# Altium project Kojiki 3.PrjPCB (part 2 of 2)

## Sheet Power_Decap.SchDoc: Power
size A4; Date: 01/09/2020; ApprovedBy: Edson Manoel da Silva; CheckedBy: Edson Manoel da Silva; Author: Edson Manoel da Silva; CompanyName: EMS; DrawnBy: Edson Manoel da Silva; Engineer: Edson Manoel da Silva; Organization: EMS; Address1: Av Helvino Moraes, 1385; Address2: APT 11E; Address3: Vila São José; Address4: Taubaté/SP - Brasil; DocumentNumber: 1; Revision: 1; SheetNumber: 1; SheetTotal: 5; Rule: 5
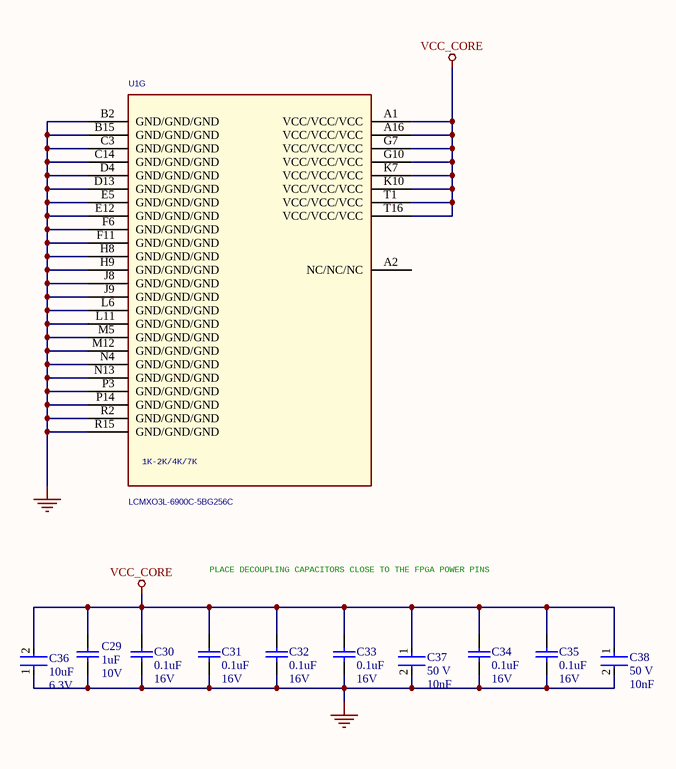
[diagram p6: Power_Decap.SchDoc]

### Parts
C29  value 1uF  Voltage: 10V  [CAPC1608X90X35ML15T15]  (hidden comment: C0603C105K8RACTU)
C30  value 0.1uF  Voltage: 16V  [CAPC1608X87X35ML15T15]  (hidden comment: C0603C104M4RACTU)
C31  value 0.1uF  Voltage: 16V  [CAPC1608X87X35ML15T15]  (hidden comment: C0603C104M4RACTU)
C32  value 0.1uF  Voltage: 16V  [CAPC1608X87X35ML15T15]  (hidden comment: C0603C104M4RACTU)
C33  value 0.1uF  Voltage: 16V  [CAPC1608X87X35ML15T15]  (hidden comment: C0603C104M4RACTU)
C34  value 0.1uF  Voltage: 16V  [CAPC1608X87X35ML15T15]  (hidden comment: C0603C104M4RACTU)
C35  value 0.1uF  Voltage: 16V  [CAPC1608X87X35ML15T15]  (hidden comment: C0603C104M4RACTU)
C36  value 10uF  Voltage: 6.3V  [FP-CL10-IPC_C]  (hidden comment: CL10A106MQ8NNNC)
C37  value 10nF  Voltage: 50 V  [FP-C0805C-DN-MFG]  (hidden comment: C0805C103K5RACAUTO)
C38  value 10nF  Voltage: 50 V  [FP-C0805C-DN-MFG]  (hidden comment: C0805C103K5RACAUTO)
U1  LCMXO3L-6900C-5BG256C  [BGA256C80P16X16_1400X1400X170]  (part G of 7)

### Nets
GND: C29.1 C30.2 C31.2 C32.2 C33.2 C34.2 C35.2 C36.1 C37.2 C38.2 U1.B2(GND/GND/GND) U1.B15(GND/GND/GND) U1.C3(GND/GND/GND) U1.C14(GND/GND/GND) U1.D4(GND/GND/GND) U1.D13(GND/GND/GND) U1.E5(GND/GND/GND) U1.E12(GND/GND/GND) U1.F6(GND/GND/GND) U1.F11(GND/GND/GND) U1.H8(GND/GND/GND) U1.H9(GND/GND/GND) U1.J8(GND/GND/GND) U1.J9(GND/GND/GND) U1.L6(GND/GND/GND) U1.L11(GND/GND/GND) U1.M5(GND/GND/GND) U1.M12(GND/GND/GND) U1.N4(GND/GND/GND) U1.N13(GND/GND/GND) U1.P3(GND/GND/GND) U1.P14(GND/GND/GND) U1.R2(GND/GND/GND) U1.R15(GND/GND/GND)
VCC_CORE: C29.2 C30.1 C31.1 C32.1 C33.1 C34.1 C35.1 C36.2 C37.1 C38.1 U1.A1(VCC/VCC/VCC) U1.A16(VCC/VCC/VCC) U1.G7(VCC/VCC/VCC) U1.G10(VCC/VCC/VCC) U1.K7(VCC/VCC/VCC) U1.K10(VCC/VCC/VCC) U1.T1(VCC/VCC/VCC) U1.T16(VCC/VCC/VCC)

Not connected (* = marked no-connect by the designer): U1 A2(NC/NC/NC)

### Notes on the sheet
- PLACE DECOUPLING CAPACITORS CLOSE TO THE FPGA POWER PINS
- Title
- Size:
- Date:
- A4
- Number:
- Time:
- Revision:
- Sheet
- of
- File:
- (in symbol LCMXO3L-1K/2K/4K/7K-BG256, part G) 1K-2K/4K/7K

### Library data of the parts
C29 = CMP-2006-02293-1: Manufacturer: Kemet; Alternative1: CL10B105KO8NNND Samsung; Alternative2: CC0603KPX7R7BB105 Yageo; Alternative3: GRM188R71C105KE15D Murata; Part Number: C0603C105K8RACTU; Package / Case: 0603
C30-C35 = CMP-2006-03067-1: as C2 on sheet Bank0_I_O; Part Number: C0603C104M4RACTU; Package / Case: 0603
C36 = CMP-13271-001938-1: as C57 on sheet bluetooth; Height: 0.8mm; Width: 0.031inch; Min Operating Temperature: -55°C; Dielectric: X5R; Package / Case: 0603; Radiation Hardening: No; Packaging: Tape and Reel; Max Operating Temperature: 85°C; Thickness: 0.035inch; Mount: Surface Mount; Case Code (Imperial): 0603; Case Code (Metric): 1608; Depth: 0.8mm; Tolerance: 20%; Length: 1.6mm; Part Number: CL10A106MQ8NNNC
C37 C38 = CMP-03020-006206-1: as C1 on sheet Bank0_I_O; Height: 0.88mm; Temperature Characteristic: X7R; Part Number: C0805C103K5RACAUTO; ComponentLink2URL: https://content.kemet.com/datasheets/KEM_C1003_C0G_SMD.pdf; RoHS: TRUE; Temperature: -55°C to +125°C; Temperature Range Low: -55°C; ComponentLink2Description: Datasheet; Package / Case: C0805C-DN; Lead Free: Yes
U1 = LCMXO3L-1K/2K/4K/7K-BG256: IC FPGA 6864LUTS 256BGA; Manufacturer: Lattice semi; SPLIT_INST: TRUE; SWAP_INFO: (S1+S2+S3+S4+S5+S6+S7); Graphic: LCMXO3L-1K/2K/4K/7K-BG256A.Normal; Power Pins Visible: False; Source Library: D:\DESIGN_DOC\XO3\LATTICEORCADCAPTURESCHEMATICLIBRARYOLB\LATTICEORCADCAPTURESCHEMATICLIBRARYOLB\LATTICE_SYM\LATTICEPLDS.OLB; Location Y-Coordinate: 0; Implementation Type: <none>; Primitive: DEFAULT; Name: I16790692; Digikey P/N: 220-1886-ND; Part Number: LCMXO3L-6900C-5BG256C; Source Package: LCMXO3L-1K/2K/4K/7K-BG256; Source Part: LCMXO3L-1K/2K/4K/7K-BG256A.Normal; Color: Default; Location X-Coordinate: 0

## Sheet usb2jtag.SchDoc
size A3
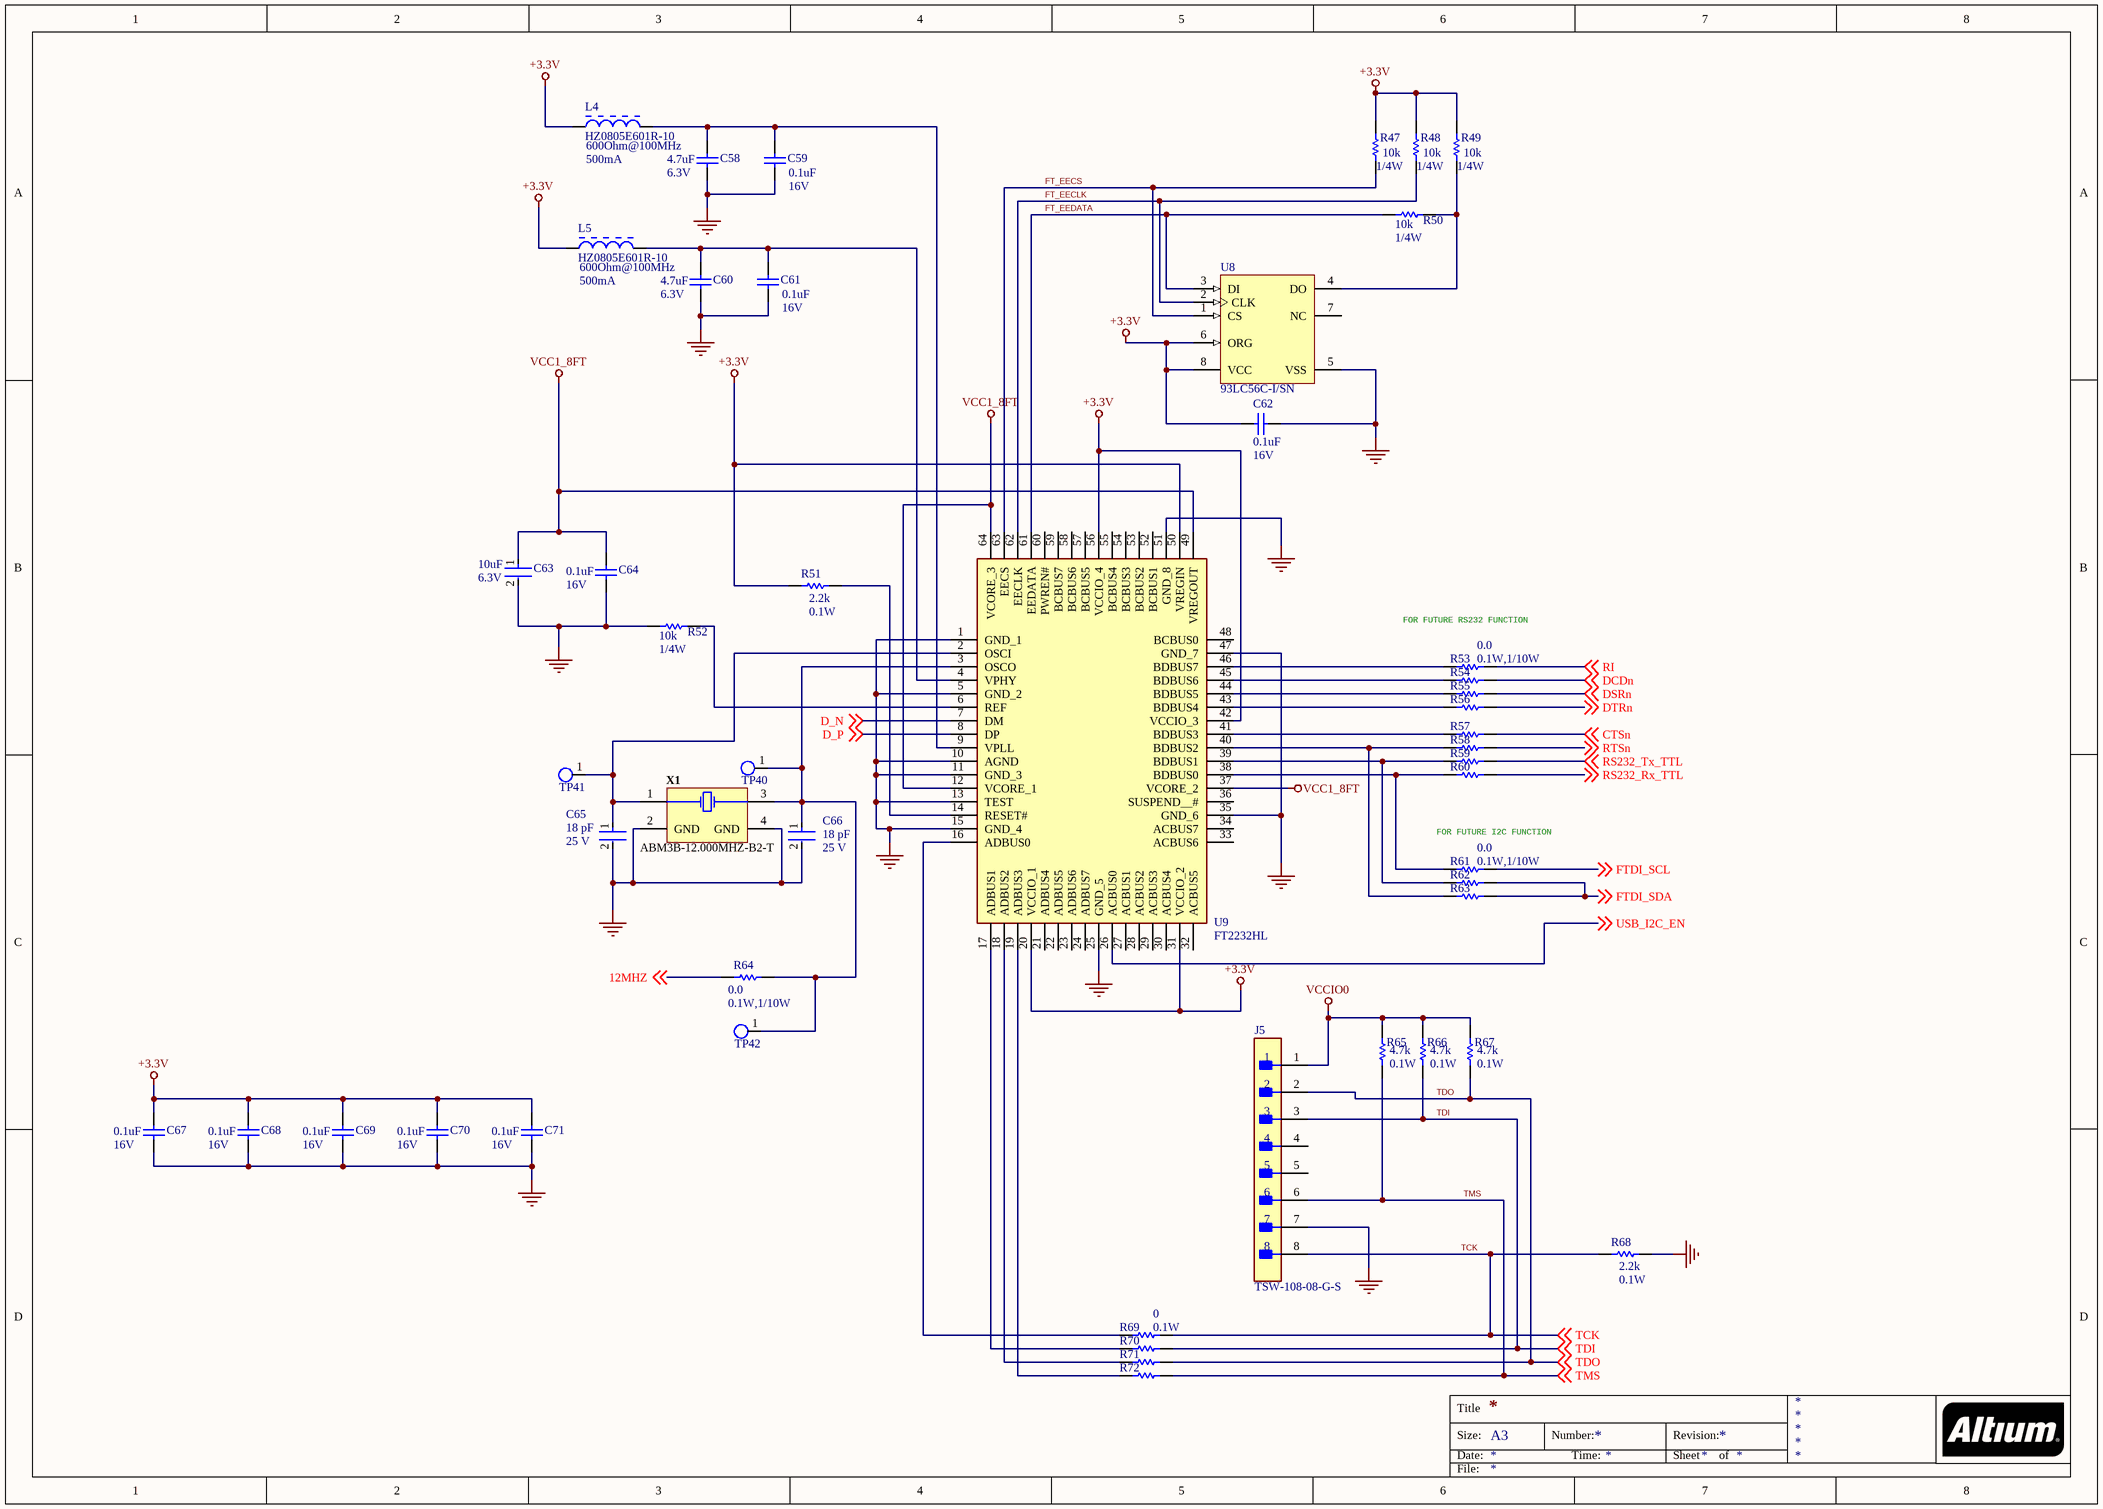
[diagram p7: usb2jtag.SchDoc]

### Parts
C58  value 4.7uF  Voltage: 6.3V  [CAPC2013X145X50NL20T25]  (hidden comment: C0805C475K9PACTU)
C59  value 0.1uF  Voltage: 16V  [CAPC1608X87X35ML15T15]  (hidden comment: C0603C104M4RACTU)
C60  value 4.7uF  Voltage: 6.3V  [CAPC2013X145X50NL20T25]  (hidden comment: C0805C475K9PACTU)
C61  value 0.1uF  Voltage: 16V  [CAPC1608X87X35ML15T15]  (hidden comment: C0603C104M4RACTU)
C62  value 0.1uF  Voltage: 16V  [CAPC1608X87X35ML15T15]  (hidden comment: C0603C104M4RACTU)
C63  value 10uF  Voltage: 6.3V  [FP-CL10-IPC_C]  (hidden comment: CL10A106MQ8NNNC)
C64  value 0.1uF  Voltage: 16V  [CAPC1608X87X35ML15T15]  (hidden comment: C0603C104M4RACTU)
C65  value 18 pF  Voltage: 25 V  [FP-C0603C-CF-MFG]  (hidden comment: C0603C180J3GACAUTO)
C66  value 18 pF  Voltage: 25 V  [FP-C0603C-CF-MFG]  (hidden comment: C0603C180J3GACAUTO)
C67  value 0.1uF  Voltage: 16V  [CAPC1608X87X35ML15T15]  (hidden comment: C0603C104M4RACTU)
C68  value 0.1uF  Voltage: 16V  [CAPC1608X87X35ML15T15]  (hidden comment: C0603C104M4RACTU)
C69  value 0.1uF  Voltage: 16V  [CAPC1608X87X35ML15T15]  (hidden comment: C0603C104M4RACTU)
C70  value 0.1uF  Voltage: 16V  [CAPC1608X87X35ML15T15]  (hidden comment: C0603C104M4RACTU)
C71  value 0.1uF  Voltage: 16V  [CAPC1608X87X35ML15T15]  (hidden comment: C0603C104M4RACTU)
J5  TSW-108-08-G-S  [FP-TSW-108-08-G-S-MFG]
L4  HZ0805E601R-10  Impedance @ Frequency: 600Ohm@100MHz  Current Rating (Max): 500mA  [LIRD-LI0805H151R-10-2_V]
L5  HZ0805E601R-10  Impedance @ Frequency: 600Ohm@100MHz  Current Rating (Max): 500mA  [LIRD-LI0805H151R-10-2_V]
R47  value 10k  Power: 1/4W  [RESC3216X70X50NL05T20]  (hidden comment: ERJ-8GEYJ103V)
R48  value 10k  Power: 1/4W  [RESC3216X70X50NL05T20]  (hidden comment: ERJ-8GEYJ103V)
R49  value 10k  Power: 1/4W  [RESC3216X70X50NL05T20]  (hidden comment: ERJ-8GEYJ103V)
R50  value 10k  Power: 1/4W  [RESC3216X70X50NL05T20]  (hidden comment: ERJ-8GEYJ103V)
R51  value 2.2k  Power: 0.1W  [RESC1608X55X25LL10T15]  (hidden comment: RC0603FR-072K2L)
R52  value 10k  Power: 1/4W  [RESC3216X70X50NL05T20]  (hidden comment: ERJ-8GEYJ103V)
R53  value 0.0  Power: 0.1W,1/10W  [RESC1608X55X35LL10T10]  (hidden comment: RC1608J000CS)
R54  RC1608J000CS  [RESC1608X55X35LL10T10]  (value not drawn)
R55  RC1608J000CS  [RESC1608X55X35LL10T10]  (value not drawn)
R56  RC1608J000CS  [RESC1608X55X35LL10T10]  (value not drawn)
R57  RC1608J000CS  [RESC1608X55X35LL10T10]  (value not drawn)
R58  RC1608J000CS  [RESC1608X55X35LL10T10]  (value not drawn)
R59  RC1608J000CS  [RESC1608X55X35LL10T10]  (value not drawn)
R60  RC1608J000CS  [RESC1608X55X35LL10T10]  (value not drawn)
R61  value 0.0  Power: 0.1W,1/10W  [RESC1608X55X35LL10T10]  (hidden comment: RC1608J000CS)
R62  RC1608J000CS  [RESC1608X55X35LL10T10]  (value not drawn)
R63  RC1608J000CS  [RESC1608X55X35LL10T10]  (value not drawn)
R64  value 0.0  Power: 0.1W,1/10W  [RESC1608X55X35LL10T10]  (hidden comment: RC1608J000CS)
R65  value 4.7k  Power: 0.1W  [RESC1608X55X25LL10T15]  (hidden comment: RC0603FR-074K7L)
R66  value 4.7k  Power: 0.1W  [RESC1608X55X25LL10T15]  (hidden comment: RC0603FR-074K7L)
R67  value 4.7k  Power: 0.1W  [RESC1608X55X25LL10T15]  (hidden comment: RC0603FR-074K7L)
R68  value 2.2k  Power: 0.1W  [RESC1608X55X25LL10T15]  (hidden comment: RC0603FR-072K2L)
R69  value 0  Power: 0.1W  [RESC1609X50X30LL8T20]  (hidden comment: CRCW06034K70FKEA)
R70  CRCW06034K70FKEA  [RESC1609X50X30LL8T20]  (value not drawn)
R71  CRCW06034K70FKEA  [RESC1609X50X30LL8T20]  (value not drawn)
R72  CRCW06034K70FKEA  [RESC1609X50X30LL8T20]  (value not drawn)
TP40  Test_Point_SMD  [Test_Point_SMD]  (value not drawn)
TP41  Test_Point_SMD  [Test_Point_SMD]  (value not drawn)
TP42  Test_Point_SMD  [Test_Point_SMD]  (value not drawn)
U8  93LC56C-I/SN  [SOIC-SN8_L]
U9  FT2232HL  [QFP50P1200X1200X160-64N]
X1  ABM3B-12.000MHZ-B2-T  [ABRA-ABM3B-4_V]

### Nets
+3.3V: C62.2 C67.2 C68.2 C69.2 C70.2 C71.2 L4.1 L5.1 R47.2 R48.2 R49.2 R51.1 U8.6(ORG) U8.8(VCC) U9.20(VCCIO_1) U9.31(VCCIO_2) U9.42(VCCIO_3) U9.50(VREGIN) U9.56(VCCIO_4)
GND: C58.1 C59.1 C60.1 C61.1 C62.1 C63.2 C64.1 C65.2 C66.2 C67.1 C68.1 C69.1 C70.1 C71.1 J5.7 R52.2 R68.2 U8.5(VSS) U9.1(GND_1) U9.5(GND_2) U9.10(AGND) U9.11(GND_3) U9.13(TEST) U9.15(GND_4) U9.25(GND_5) U9.35(GND_6) U9.47(GND_7) U9.51(GND_8) X1.2(GND) X1.4(GND)
VCC1_8FT: C63.1 C64.2 U9.12(VCORE_1) U9.37(VCORE_2) U9.49(VREGOUT) U9.64(VCORE_3)
VCCIO0: J5.1 R65.2 R66.2 R67.2
12MHZ: R64.1 ; off-sheet 12MHZ
CTSn: R57.2 ; off-sheet CTSn
D_N: U9.7(DM) ; off-sheet D_N
D_P: U9.8(DP) ; off-sheet D_P
DCDn: R54.2 ; off-sheet DCDn
DSRn: R55.2 ; off-sheet DSRn
DTRn: R56.2 ; off-sheet DTRn
FT_EECLK: R48.1 U8.2(CLK) U9.62(EECLK)
FT_EECS: R47.1 U8.1(CS) U9.63(EECS)
FT_EEDATA: R50.2 U8.3(DI) U9.61(EEDATA)
FTDI_SCL: R61.2 ; off-sheet FTDI_SCL
FTDI_SDA: R62.2 R63.2 ; off-sheet FTDI_SDA
RI: R53.2 ; off-sheet RI
RS232_Rx_TTL: R60.2 ; off-sheet RS232_Rx_TTL
RS232_Tx_TTL: R59.2 ; off-sheet RS232_Tx_TTL
RTSn: R58.2 ; off-sheet RTSn
TCK: J5.8 R68.1 R69.1 ; off-sheet TCK
TDI: J5.3 R66.1 R70.1 ; off-sheet TDI
TDO: J5.2 R67.1 R71.1 ; off-sheet TDO
TMS: J5.6 R65.1 R72.1 ; off-sheet TMS
USB_I2C_EN: U9.26(ACBUS0) ; off-sheet USB_I2C_EN
NetC58_2: C58.2 C59.2 L4.2 U9.9(VPLL)
NetC60_2: C60.2 C61.2 L5.2 U9.4(VPHY)
NetC65_1: C65.1 TP41.1(TP) U9.2(OSCI) X1.1(X1)
NetC66_1: C66.1 R64.2 TP40.1(TP) TP42.1(TP) U9.3(OSCO) X1.3(X2)
NetR49_1: R49.1 R50.1 U8.4(DO)
NetR51_2: R51.2 U9.14(RESET#)
NetR52_1: R52.1 U9.6(REF)
NetR53_1: R53.1 U9.46(BDBUS7)
NetR54_1: R54.1 U9.45(BDBUS6)
NetR55_1: R55.1 U9.44(BDBUS5)
NetR56_1: R56.1 U9.43(BDBUS4)
NetR57_1: R57.1 U9.41(BDBUS3)
NetR58_1: R58.1 R63.1 U9.40(BDBUS2)
NetR59_1: R59.1 R62.1 U9.39(BDBUS1)
NetR60_1: R60.1 R61.1 U9.38(BDBUS0)
NetR69_2: R69.2 U9.16(ADBUS0)
NetR70_2: R70.2 U9.17(ADBUS1)
NetR71_2: R71.2 U9.18(ADBUS2)
NetR72_2: R72.2 U9.19(ADBUS3)

Not connected (* = marked no-connect by the designer): J5 4 5; U8 7(NC); U9 21(ADBUS4) 22(ADBUS5) 23(ADBUS6) 24(ADBUS7) 27(ACBUS1) 28(ACBUS2) 29(ACBUS3) 30(ACBUS4) 32(ACBUS5) 33(ACBUS6) 34(ACBUS7) 36(SUSPEND__#) 48(BCBUS0) 52(BCBUS1) 53(BCBUS2) 54(BCBUS3) 55(BCBUS4) 57(BCBUS5) 58(BCBUS6) 59(BCBUS7) 60(PWREN#)

### Notes on the sheet
- FOR FUTURE RS232 FUNCTION
- FOR FUTURE I2C FUNCTION
- Title
- Size:
- Date:
- A3
- Number:
- Time:
- Revision:
- Sheet
- of
- File:

### Library data of the parts
C58 C60 = CMP-2007-01009-1: as C52 on sheet bluetooth; Part Number: C0805C475K9PACTU; Package / Case: 0805
C59 C61 C62 C64 C67-C71 = CMP-2006-03067-1: as C2 on sheet Bank0_I_O; Part Number: C0603C104M4RACTU; Package / Case: 0603
C63 = CMP-13271-001938-1: as C57 on sheet bluetooth; Height: 0.8mm; Width: 0.031inch; Min Operating Temperature: -55°C; Dielectric: X5R; Package / Case: 0603; Radiation Hardening: No; Packaging: Tape and Reel; Max Operating Temperature: 85°C; Thickness: 0.035inch; Mount: Surface Mount; Case Code (Imperial): 0603; Case Code (Metric): 1608; Depth: 0.8mm; Tolerance: 20%; Length: 1.6mm; Part Number: CL10A106MQ8NNNC
C65 C66 = CMP-03020-020748-1: CAP CER 18PF 25V C0G/NP0 0603; Manufacturer: KEMET; Tolerance: 0.05; Temperature Characteristic: C0G; Material: Ceramic; Temperature Coefficient: 30ppm/°C; Automotive: Yes; Package / Case: C0603C-CF; Device Class L2: Capacitors; Part Number: C0603C180J3GACAUTO; ComponentLink2Description: Datasheet; Device Class L3: Ceramic Capacitors; Temperature Range Low: -55°C; Temperature Range High: +125°C; Lead Free: Yes; Digikey Description: CAP CER 18PF 25V C0G/NP0 0603; Temperature: -55°C to +125°C; Octopart: https://octopart.com/c0603c180j3gacauto-kemet-21982873; Height: 0.87mm; Capacitance: 18 pF; RoHS: TRUE; ComponentLink2URL: https://api.kemet.com/component-edge/download/datasheet/C0603C100J5GACAUTO.pdf
J5 = CMP-02766-000001-1: CONN HEADER VERT 8POS 2.54MM; Manufacturer: Samtec; Number Of Contacts: 8; Conn Orientation: Straight; Conn Gender: Male; Device Class L1: Connectors; ComponentLink2Description: Datasheet; Digikey Description: CONN HEADER VERT 8POS 2.54MM; ComponentLink2URL: http://suddendocs.samtec.com/catalog_english/tsw_th.pdf; Temperature: -55°C to +125°C; RoHS: TRUE; Mouser Description: TSW - Samtec 2.54mm Pin Header 13.46mm Overall Pin Length 5.08mm Tail; Automotive: No; Temperature Range High: +125°C; Package: TSW-108-08-G-S; Device Class L3: unset; Manufacturer Part Number: TSW-108-08-G-S; Pitch: 2.54mm; Number Of Rows: 1; Lead Free: Yes; Height: 8.71mm; Contact Material: Gold,Nickel; Footprint Url: http://suddendocs.samtec.com/prints/tsw-xxx-xx-x-x-xx-xxx-footprint.pdf; Temperature Range Low: -55°C; Octopart: https://octopart.com/tsw-108-08-g-s-samtec-272653; Category: Conn; Device Class L2: Headers and Wire Housings
L4 = CMP-2000-05194-1: Chip Bead for Signal Filtering, 600 Ohm, 500 mA, -40 to 125 degC, 0805 (2012 Metric), RoHS, Tape and Reel; Manufacturer: Laird; Other Names: 240-2399-1; DC Resistance (DCR) (Max): 300mOhm; Operating Temperature: -40degC~125degC; Datasheet URL: https://datasheet.ciiva.com/22622/1685710-22622833.pdf; Mounting Type: SurfaceMount; Package / Case: 0805(2012Metric); Package Description: 2-Pin Surface Mount Device, Body 2 x 1.25 mm; Package Reference: LI0805H15R-10-2; Size / Dimension: 0.079"Lx0.049"W(2.00mmx1.25mm); Height (Max): 0.043"(1.10mm); Part Number: HZ0805E601R-10
L5 = CMP-2000-05194-1: as L2 on sheet bluetooth; Operating Temperature: -40degC~125degC; Datasheet URL: https://datasheet.ciiva.com/22622/1685710-22622833.pdf; Mounting Type: SurfaceMount; Package / Case: 0805(2012Metric); Package Description: 2-Pin Surface Mount Device, Body 2 x 1.25 mm; Package Reference: LI0805H15R-10-2; Size / Dimension: 0.079"Lx0.049"W(2.00mmx1.25mm); Height (Max): 0.043"(1.10mm); Part Number: HZ0805E601R-10
R47-R50 R52 = CMP-2003-00545-1: as R7 on sheet Bank0_I_O; Part Number: ERJ-8GEYJ103V; Package / Case: 1206
R51 R68 = CMP-2000-06934-1: as R1 on sheet Bank0_I_O; Tolerance: 1%; Datasheet Version: Rev. 7, 05/2017; Case Code - mm: 1608; Series: RC; Mounting Technology: SurfaceMount; Package Description: 2-Pin Surface Mount Device, Body 1.6 x 0.8 mm; Package / Case: 0603; Package Reference: 0603; Product: ThickFilmResistorsGeneralPurpose; Manufacturer URL: http://www.yageo.com/; Termination Style: SMD/SMT; Operating Temperature Range: -55Cto+155C; Datasheet URL: http://www.yageo.com/documents/recent/PYu-RC_Group_51_RoHS_L_7.pdf; Packaging: Reel
R53 R61 R64 = CMP-2000-06972-1: as R16 on sheet Bank2_I_O; Manufacturer URL: http://www.samsungsem.com/global/index.jsp; Features: MoistureResistant; Mounting Technology: SurfaceMount; Series: RC; Package / Case: 0603(1608Metric); Category: Resistors; Operating Temperature: -55°C~155°C; Datasheet URL: http://static6.arrow.com/aropdfconversion/3cece72dd289ffbadc164fbcd05f638dd7240f7b/rc_datasheet_150330.pdf.pdf?authToken=eyJ0eXAiOiJKV1QiLCJhbGciOiJIUzI1NiJ9.eyJTZXNzaW9uSWQiOiJtY3ZlYXdxYmptZXdpdXdyeG1ha2FxdWciLCJEb3dubG9hZFR5cGUiOiJEYXRhc2hlZXRzIiwiaXNzIjoic2VsZiIsImF1ZCI6Imh0dHA6Ly9kYXRhc2hlZXRhdXRoLmFycm93LmNvbSIsImV4cCI6MTQ3Njg1OTQ5NiwibmJmIjoxNDc2ODU5Mzc2fQ.1rZWSrRNyHkP6J5YmszFzS2kzmlbN9BKNvWJ4ACiP-Q; Datasheet Version: 09/2015; Composition: ThickFilm; Package Description: 2-Pin Chip Resistor, Body 1.6 x 0.8 mm; Height: 0.022"(0.55mm); Family: ChipResistor-SurfaceMount; Temperature Coefficient: -; Size / Dimension: 0.063"Lx0.031"W(1.60mmx0.80mm); Part Number: RC1608J000CS
R54-R60 R62 R63 = CMP-2000-06972-1: Chip Resistor, 0 Ohm, +/- 5%, 0.1 W, -55 to 155 degC, 0603 (1608 Metric), RoHS, Tape and Reel; Manufacturer: Samsung-Electro-Mechanics-America,-Inc.; Power: 0.1W,1/10W; Value: 0.0; Tolerance: Jumper; Alternative1: RC0603JR-130RL Yageo; Alternative2: RC0603JR-100RL Yageo; Alternative3: CRCW0603-0000Z0EA Vishay; Manufacturer URL: http://www.samsungsem.com/global/index.jsp; Features: MoistureResistant; Mounting Technology: SurfaceMount; Series: RC; Package / Case: 0603(1608Metric); Category: Resistors; Operating Temperature: -55°C~155°C; Datasheet URL: http://static6.arrow.com/aropdfconversion/3cece72dd289ffbadc164fbcd05f638dd7240f7b/rc_datasheet_150330.pdf.pdf?authToken=eyJ0eXAiOiJKV1QiLCJhbGciOiJIUzI1NiJ9.eyJTZXNzaW9uSWQiOiJtY3ZlYXdxYmptZXdpdXdyeG1ha2FxdWciLCJEb3dubG9hZFR5cGUiOiJEYXRhc2hlZXRzIiwiaXNzIjoic2VsZiIsImF1ZCI6Imh0dHA6Ly9kYXRhc2hlZXRhdXRoLmFycm93LmNvbSIsImV4cCI6MTQ3Njg1OTQ5NiwibmJmIjoxNDc2ODU5Mzc2fQ.1rZWSrRNyHkP6J5YmszFzS2kzmlbN9BKNvWJ4ACiP-Q; Datasheet Version: 09/2015; Composition: ThickFilm; Package Description: 2-Pin Chip Resistor, Body 1.6 x 0.8 mm; Height: 0.022"(0.55mm); Family: ChipResistor-SurfaceMount; Temperature Coefficient: -; Size / Dimension: 0.063"Lx0.031"W(1.60mmx0.80mm); Part Number: RC1608J000CS
R65-R67 = CMP-2000-06942-1: Chip Resistor, 4.7 KOhm, +/- 1%, 0.1 W, -55 to 155 degC, 0603 (1608 Metric), RoHS, Tape and Reel; Manufacturer: Yageo; Temperature Coefficient: 100PPM/C; Voltage Rating: 50V; Package / Case: 0603; Series: RC; Datasheet URL: http://www.yageo.com/documents/recent/PYu-RC_Group_51_RoHS_L_7.pdf; Case Code - mm: 1608; Operating Temperature Range: -55Cto+155C; Tolerance: 1%
R69 = CMP-1666-00019-2: Chip Resistor, 4.7 KOhm, +/- 1%, 100 mW, -55 to 155 degC, 0603 (1608 Metric), RoHS, Tape and Reel; Manufacturer: Vishay; Alternative 1: RC0603FR-134K7L Yageo; Alternative 2: WR06X4701FGL Walsin Technologies; Alternative 3: CRCW06031R50FNEA Vishay Dale; ComponentLink1Description: Manufacturer URL; RoHSCompliant: true; ComponentLink2URL: http://www.vishay.com/docs/20035/dcrcwe3.pdf; Package / Case: 0603; ComponentLink2Description: Datasheet; ComponentLink1URL: http://www.vishay.com/; Part Number: CRCW06034K70FKEA
R70-R72 = CMP-1666-00019-2: Chip Resistor, 4.7 KOhm, +/- 1%, 100 mW, -55 to 155 degC, 0603 (1608 Metric), RoHS, Tape and Reel; Manufacturer: Vishay; Alternative 1: RC0603FR-134K7L Yageo; Alternative 2: WR06X4701FGL Walsin Technologies; Alternative 3: CRCW06031R50FNEA Vishay Dale; Value: 0; Power: 0.1W; ComponentLink1Description: Manufacturer URL; RoHSCompliant: true; ComponentLink2URL: http://www.vishay.com/docs/20035/dcrcwe3.pdf; Package / Case: 0603; ComponentLink2Description: Datasheet; ComponentLink1URL: http://www.vishay.com/; Part Number: CRCW06034K70FKEA
U8 = CMP-0162-00111-1: 2K, 256x8 or 128x16-bit, 2.5V Microwire Serial EEPROM, 8-Pin SOIC 150mil, Industrial Temperature; ComponentAvailability: Unknown. Contact manufacturer to determine status.; PackageReference: SOIC-SN8; PackageVersion: revBB, Aug-2009; Code_IPC: SOIC127P600-8; PackageDescription: 8-Lead Plastic Small Outline (SN) - Narrow, 3.90mm Body [SOIC]; DatasheetVersion: revF, May-2008; Code_JEDEC: MS-012
U9 = FT2232HL-REEL: Integrated Circuit; Manufacturer: FTDI Chip; Datasheet Link: http://www.ftdichip.com/Support/Documents/DataSheets/ICs/DS_FT2232H.pdf; Height: 1.6mm; Part Number: FT2232HL; Arrow Part Number: FT2232HL-REEL; Arrow Price/Stock: https://www.arrow.com/en/products/ft2232hl-reel/ftdi-chip; Mouser Part Number: 895-FT2232HL; Mouser Price/Stock: https://www.mouser.co.uk/ProductDetail/FTDI/FT2232HL-REEL?qs=D1%2FPMqvA100v7FHcEx164g%3D%3D; Package / Case: QFP50
X1 = CMP-1688-00007-1: Ceramic SMD Crystal, 12 MHz, +/- 20 ppm, 70 Ohm, -20 to 70 degC, 4-Pin SMD, RoHS, Tape and Reel; Manufacturer: Abracon; Max Input Voltage: 25 V; Dropout Voltage: 2 V; Max Ouput Current: 1.5 A; Nominal Output Voltage: 5 V; Min Input Voltage: 7 V; Package / Case: TO-263-4; Mount: Surface Mount; ComponentLink2Description: Datasheet; DatasheetVersion: Aug-15; PackageReference: ABM3B; Radiation Hardening: No; Weight: 0.050897 oz; ComponentLink1URL: http://www.abracon.com/; RoHSCompliant: true; Max Operating Temperature: 125 degC; PackageDescription: 4-Pin Surface Mount Device, Body 5 x 3.2 mm; ComponentLink1Description: Manufacturer URL; Package Quantity: 500; Output Voltage: 5 V; ComponentLink2URL: http://www.abracon.com/Resonators/abm3b.pdf; Min Operating Temperature: 0 degC; Output Current: 1.5 A; Packaging: Tape and Reel; Pins: 3; REACH SVHC: No SVHC; Part Number: ABM3B-12.000MHZ-B2-T

## Sheet analog_front_end.SchDoc
size A3; Organization: EMS; Address1: Av Helvino Moraes, 1385; Address2: Vila São José; Address3: Taubaté-SP; Address4: Brazil
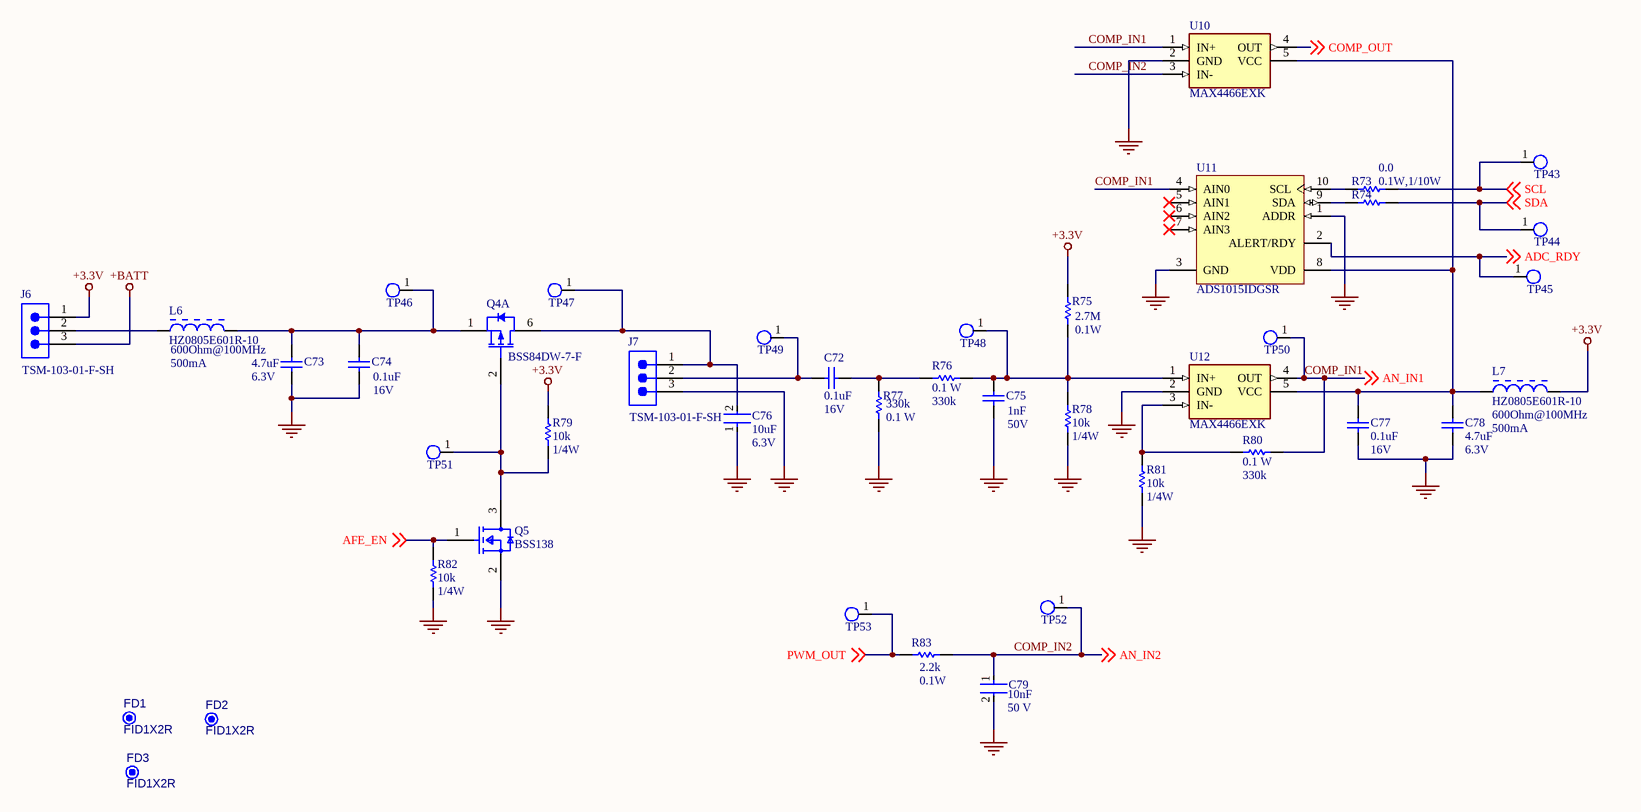
[diagram p8: analog_front_end.SchDoc]

### Parts
C72  value 0.1uF  Voltage: 16V  [CAPC1608X87X35ML15T15]  (hidden comment: C0603C104M4RACTU)
C73  value 4.7uF  Voltage: 6.3V  [CAPC2013X145X50NL20T25]  (hidden comment: C0805C475K9PACTU)
C74  value 0.1uF  Voltage: 16V  [CAPC1608X87X35ML15T15]  (hidden comment: C0603C104M4RACTU)
C75  value 1nF  Voltage: 50V  [CAPC1608X90X35LL15T15]  (hidden comment: 06035C102KAT2A)
C76  value 10uF  Voltage: 6.3V  [FP-CL10-IPC_C]  (hidden comment: CL10A106MQ8NNNC)
C77  value 0.1uF  Voltage: 16V  [CAPC1608X87X35ML15T15]  (hidden comment: C0603C104M4RACTU)
C78  value 4.7uF  Voltage: 6.3V  [CAPC2013X145X50NL20T25]  (hidden comment: C0805C475K9PACTU)
C79  value 10nF  Voltage: 50 V  [FP-C0805C-DN-MFG]  (hidden comment: C0805C103K5RACAUTO)
FD1  FID1X2R  [FID1X2R]  (no BOM)
FD2  FID1X2R  [FID1X2R]  (no BOM)
FD3  FID1X2R  [FID1X2R]  (no BOM)
J6  TSM-103-01-F-SH  [SMTC-TSM-103-01-X-SH-A]
J7  TSM-103-01-F-SH  [SMTC-TSM-103-01-X-SH-A]
L6  HZ0805E601R-10  Impedance @ Frequency: 600Ohm@100MHz  Current Rating (Max): 500mA  [LIRD-LI0805H151R-10-2_V]
L7  HZ0805E601R-10  Impedance @ Frequency: 600Ohm@100MHz  Current Rating (Max): 500mA  [LIRD-LI0805H151R-10-2_V]
Q4  BSS84DW-7-F  [DIOD-SOT363-6_V]  (part A of 2)
Q5  BSS138  [FP-318-08-IPC_B]
R73  value 0.0  Power: 0.1W,1/10W  [RESC1608X55X35LL10T10]  (hidden comment: RC1608J000CS)
R74  RC1608J000CS  [RESC1608X55X35LL10T10]  (value not drawn)
R75  value 2.7M  Power: 0.1W  [RESC1609X50X30ML10T20]  (hidden comment: CRCW06032M70JNEA)
R76  value 330k  Power: 0.1 W  [RESC0603(1608)_M]  (hidden comment: 330K 1% 0603(1608))
R77  value 330k  Power: 0.1 W  [RESC0603(1608)_M]  (hidden comment: 330K 1% 0603(1608))
R78  value 10k  Power: 1/4W  [RESC3216X70X50NL05T20]  (hidden comment: ERJ-8GEYJ103V)
R79  value 10k  Power: 1/4W  [RESC3216X70X50NL05T20]  (hidden comment: ERJ-8GEYJ103V)
R80  value 330k  Power: 0.1 W  [RESC0603(1608)_M]  (hidden comment: 330K 1% 0603(1608))
R81  value 10k  Power: 1/4W  [RESC3216X70X50NL05T20]  (hidden comment: ERJ-8GEYJ103V)
R82  value 10k  Power: 1/4W  [RESC3216X70X50NL05T20]  (hidden comment: ERJ-8GEYJ103V)
R83  value 2.2k  Power: 0.1W  [RESC1608X55X25LL10T15]  (hidden comment: RC0603FR-072K2L)
TP43  Test_Point_SMD  [Test_Point_SMD]  (value not drawn)
TP44  Test_Point_SMD  [Test_Point_SMD]  (value not drawn)
TP45  Test_Point_SMD  [Test_Point_SMD]  (value not drawn)
TP46  Test_Point_SMD  [Test_Point_SMD]  (value not drawn)
TP47  Test_Point_SMD  [Test_Point_SMD]  (value not drawn)
TP48  Test_Point_SMD  [Test_Point_SMD]  (value not drawn)
TP49  Test_Point_SMD  [Test_Point_SMD]  (value not drawn)
TP50  Test_Point_SMD  [Test_Point_SMD]  (value not drawn)
TP51  Test_Point_SMD  [Test_Point_SMD]  (value not drawn)
TP52  Test_Point_SMD  [Test_Point_SMD]  (value not drawn)
TP53  Test_Point_SMD  [Test_Point_SMD]  (value not drawn)
U10  MAX4466EXK  [SOT95P280X145-5N]
U11  ADS1015IDGSR  [TI-DGS10_N]
U12  MAX4466EXK  [SOT95P280X145-5N]

### Nets
+3.3V: J6.1 L7.1 R75.2 R79.1
+BATT: J6.3
GND: C73.1 C74.1 C75.1 C76.1 C77.1 C78.1 C79.2 J7.3 Q5.2(S) R77.1 R78.2 R81.2 R82.2 U10.2(GND) U11.1(ADDR) U11.3(GND) U12.2(GND)
ADC_RDY: TP45.1(TP) U11.2(ALERT/RDY) ; off-sheet ADC_RDY  [project net IO_T7]
AFE_EN: Q5.1(G) R82.1 ; off-sheet AFE_EN  [project net IO_R13]
COMP_IN1: R80.1 TP50.1(TP) U10.1(IN+) U11.4(AIN0) U12.4(OUT) ; off-sheet AN_IN1  [also labelled AN_IN1]
COMP_IN2: C79.1 R83.2 TP52.1(TP) U10.3(IN-) ; off-sheet AN_IN2  [also labelled AN_IN2]
COMP_OUT: U10.4(OUT) ; off-sheet COMP_OUT  [project net IO_T5]
PWM_OUT: R83.1 TP53.1(TP) ; off-sheet PWM_OUT  [project net IO_T9]
SCL: R73.2 TP43.1(TP) ; off-sheet SCL
SDA: R74.2 TP44.1(TP) ; off-sheet SDA
NetC72_1: C72.1 J7.2 TP49.1(TP)
NetC72_2: C72.2 R76.2 R77.2
NetC73_2: C73.2 C74.2 L6.2 Q4.1(S) TP46.1(TP)
NetC75_2: C75.2 R75.1 R76.1 R78.1 TP48.1(TP) U12.1(IN+)
NetC76_2: C76.2 J7.1 Q4.6(D) TP47.1(TP)
NetC77_2: C77.2 C78.2 L7.2 U10.5(VCC) U11.8(VDD) U12.5(VCC)
NetJ6_2: J6.2 L6.1
NetQ4_2: Q4.2(G) Q5.3(D) R79.2 TP51.1(TP)
NetR73_1: R73.1 U11.10(SCL)
NetR74_1: R74.1 U11.9(SDA)
NetR80_2: R80.2 R81.1 U12.3(IN-)

Not connected (* = marked no-connect by the designer): U11 5(AIN1)* 6(AIN2)* 7(AIN3)*

### Notes on the sheet
- Title
- Size:
- Date:
- A3
- Number:
- Time:
- Revision:
- Sheet
- of
- File:

### Library data of the parts
C72 C74 C77 = CMP-2006-03067-1: Ceramic Capacitor 0.1uF 16V +-10% X7R0603; Manufacturer: Kemet; Alternative1: C1608X7R1E104K TDK; Alternative2: CC0603KRX7R8BB104 Yageo; Alternative3: GRM188R72A104KA35D Murata; Part Number: C0603C104M4RACTU; Package / Case: 0603
C73 C78 = CMP-2007-01009-1: Manufacturer: Kemet; Alternative1: GRM219R61A475KE34D Murata; Alternative2: C0805C475K3PACTU KEMET; Alternative3: CC0805KKX5R7BB475 Yageo; Part Number: C0805C475K9PACTU; Package / Case: 0805
C75 = CMP-2006-04378-1: Manufacturer: AVX Interconnect / Elco; Part Number: 06035C102KAT2A
C76 = CMP-13271-001938-1: Cap Ceramic 10uF 6.3V X5R ±20% Pad SMD 0603 +85°C T/R; Manufacturer: Samsung; Alternative1: LMK107BJ106MALTD Taiyo Yuden; Alternative2: C1608X5R0J106K080AB TDK; Alternative3: 06036D106MAT2A Kyocera AVX; Height: 0.8mm; Width: 0.031inch; Min Operating Temperature: -55°C; Dielectric: X5R; Package / Case: 0603; Radiation Hardening: No; Packaging: Tape and Reel; Max Operating Temperature: 85°C; Thickness: 0.035inch; Mount: Surface Mount; Case Code (Imperial): 0603; Case Code (Metric): 1608; Depth: 0.8mm; Tolerance: 20%; Length: 1.6mm; Part Number: CL10A106MQ8NNNC
C79 = CMP-03020-006206-1: CAP CER 10000PF 50V X7R 0805; Manufacturer: KEMET; Material: Ceramic; Temperature Coefficient: 30ppm/°C; Alternative1: GRM21BR72A103KA01L Murata; Alternative2: C0805F103K5RACTU KEMET; Alternative3: 08055C103JAT2A Kyocera AVX; Height: 0.88mm; Temperature Characteristic: X7R; Part Number: C0805C103K5RACAUTO; ComponentLink2URL: https://content.kemet.com/datasheets/KEM_C1003_C0G_SMD.pdf; RoHS: TRUE; Temperature: -55°C to +125°C; Temperature Range Low: -55°C; ComponentLink2Description: Datasheet; Package / Case: C0805C-DN; Lead Free: Yes
FD1-FD3 = CMP-00028-00005-1: Fiducial - Round 1x2mm; Pins: 0
J6 J7 = CMP-1024-00212-1: 0.025" SQ Post Header, Surface Mount, Horizontal, -55 to 125 degC, 2.54 mm Pitch, 3-Pin, Male, RoHS; Manufacturer: Samtec; Pitch: 2.54 mm; ComponentLink1Description: Manufacturer URL; Temperature Range: -55 to 125 degC; Part Number: TSM-103-01-F-SH; Orientation: Horizontal; ComponentLink1URL: http://www.samtec.com; ComponentLink2Description: Datasheet; Mounting Technology: Surface Mount; RoHS: True; ComponentLink3URL: http://www.samtec.com/documents/webfiles/cpdf/TSM-1XX-XX-XXX-SH-XX-XXX-XX-MKT1.pdf; ComponentLink3Description: Package Specification; ComponentLink2URL: http://www.samtec.com/documents/webfiles/pdf/TSM.PDF
L6 L7 = CMP-2000-05194-1: Chip Bead for Signal Filtering, 600 Ohm, 500 mA, -40 to 125 degC, 0805 (2012 Metric), RoHS, Tape and Reel; Manufacturer: Laird; Other Names: 240-2399-1; Kits: 240-2227-ND-KITEMIFERRITEBEADCHIPSMD; DC Resistance (DCR) (Max): 300mOhm; Filter Type: SignalLine; Operating Temperature: -40degC~125degC; Datasheet URL: https://datasheet.ciiva.com/22622/1685710-22622833.pdf; Mounting Type: SurfaceMount; Package / Case: 0805(2012Metric); Package Description: 2-Pin Surface Mount Device, Body 2 x 1.25 mm; Package Reference: LI0805H15R-10-2; Size / Dimension: 0.079"Lx0.049"W(2.00mmx1.25mm); Height (Max): 0.043"(1.10mm); Part Number: HZ0805E601R-10
Q4 = CMP-2000-05971-1: Dual P-Channel Enhancement Mode MOSFET, 50 VDS, -55 to 150 degC, 6-Pin SOT363, RoHS, Tape and Reel; Manufacturer: DiodesIncorporated; Vgs - Gate-Source Voltage: 20V; Typical Turn-On Delay Time: 10ns; Forward Transconductance - Min: 0.05S; Id - Continuous Drain Current: -130mA; Transistor Type: 2P-Channel; Typical Turn-Off Delay Time: 18ns; Unit Weight: 0.000212oz; Vds - Drain-Source Breakdown Voltage: -50V; Number of Channels: 2Channel; Pd - Power Dissipation: 300mW; Type: EnhancementModeFieldEffectTransistor; Rds On - Drain-Source Resistance: 6Ohms; Package Description: 6-Pin Small Outline Transistor, Body 1.25 x 2 mm, Pitch 0.65 mm; RoHS: True; Manufacturer URL: http://www.diodes.com/; Packaging: Reel; Series: BSS84; Mounting Style: SMD/SMT; Technology: Si; Height: 1mm; Configuration: Dual; Package Reference: SOT363-6; Length: 2.2mm; Mounting Technology: SurfaceMount; Factory Pack Quantity: 3000; Brand: DiodesIncorporated; Maximum Operating Temperature: +150C; Minimum Operating Temperature: -55C; Product Category: MOSFET; Datasheet URL: http://www.diodes.com/_files/datasheets/ds30204.pdf; Width: 1.35mm; Product: MOSFETSmallSignal; Channel Mode: Enhancement; Transistor Polarity: P-Channel; Datasheet Version: Rev. 18-2, 01/2014; Package / Case: SOT-363-6
Q5 = CMP-07173-000101-1: MOSFET N-CH 50V 220MA SOT-23; Turn-Off Delay Time: 20ns; Element Configuration: Single; Rds On Max: 3.5R; Gate to Source Voltage (Vgs): 20V; Threshold Voltage: 1.3V; Number of Elements: 1; Power Dissipation: 360mW; Rise Time: 9ns; Turn-On Delay Time: 2.5ns; Input Capacitance: 27pF; On-State Resistance: 6R; Alternative1: BSS138LT3G ON Semiconductor; Alternative2: BSS138W-7-F Diodes; Alternative3: 2N7002 STMicroelectronics; Lead Free: Lead Free; Length: 2.92mm; Width: 1.3mm; Drain to Source Breakdown Voltage: 50V; Min Operating Temperature: -55°C; REACH SVHC: No SVHC; Packaging: Tape and Reel; Radiation Hardening: No; Height: 0.93mm; Drain to Source Voltage (Vdss): 50V; Current Rating: 220mA; Voltage Rating (DC): 50V; Weight: 0.03g; Continuous Drain Current (ID): 220mA; Number of Pins: 3; Nominal Vgs: 1.3V; Max Power Dissipation: 360mW; Fall Time: 9ns; Drain to Source Resistance: 3.5R; Contact Plating: Tin; Case/Package: SOT-23; Package Quantity: 1; Dual Supply Voltage: 50V; Mount: Surface Mount; Termination: SMD/SMT; Max Operating Temperature: 150°C
R73 = CMP-2000-06972-1: Chip Resistor, 0 Ohm, +/- 5%, 0.1 W, -55 to 155 degC, 0603 (1608 Metric), RoHS, Tape and Reel; Manufacturer: Samsung-Electro-Mechanics-America,-Inc.; Tolerance: Jumper; Alternative1: RC0603JR-130RL Yageo; Alternative2: RC0603JR-100RL Yageo; Alternative3: CRCW0603-0000Z0EA Vishay; Manufacturer URL: http://www.samsungsem.com/global/index.jsp; Features: MoistureResistant; Mounting Technology: SurfaceMount; Series: RC; Package / Case: 0603(1608Metric); Category: Resistors; Operating Temperature: -55°C~155°C; Datasheet URL: http://static6.arrow.com/aropdfconversion/3cece72dd289ffbadc164fbcd05f638dd7240f7b/rc_datasheet_150330.pdf.pdf?authToken=eyJ0eXAiOiJKV1QiLCJhbGciOiJIUzI1NiJ9.eyJTZXNzaW9uSWQiOiJtY3ZlYXdxYmptZXdpdXdyeG1ha2FxdWciLCJEb3dubG9hZFR5cGUiOiJEYXRhc2hlZXRzIiwiaXNzIjoic2VsZiIsImF1ZCI6Imh0dHA6Ly9kYXRhc2hlZXRhdXRoLmFycm93LmNvbSIsImV4cCI6MTQ3Njg1OTQ5NiwibmJmIjoxNDc2ODU5Mzc2fQ.1rZWSrRNyHkP6J5YmszFzS2kzmlbN9BKNvWJ4ACiP-Q; Datasheet Version: 09/2015; Composition: ThickFilm; Package Description: 2-Pin Chip Resistor, Body 1.6 x 0.8 mm; Height: 0.022"(0.55mm); Family: ChipResistor-SurfaceMount; Temperature Coefficient: -; Size / Dimension: 0.063"Lx0.031"W(1.60mmx0.80mm); Part Number: RC1608J000CS
R74 = CMP-2000-06972-1: Chip Resistor, 0 Ohm, +/- 5%, 0.1 W, -55 to 155 degC, 0603 (1608 Metric), RoHS, Tape and Reel; Manufacturer: Samsung-Electro-Mechanics-America,-Inc.; Power: 0.1W,1/10W; Value: 0.0; Tolerance: Jumper; Alternative1: RC0603JR-130RL Yageo; Alternative2: RC0603JR-100RL Yageo; Alternative3: CRCW0603-0000Z0EA Vishay; Manufacturer URL: http://www.samsungsem.com/global/index.jsp; Features: MoistureResistant; Mounting Technology: SurfaceMount; Series: RC; Package / Case: 0603(1608Metric); Category: Resistors; Operating Temperature: -55°C~155°C; Datasheet URL: http://static6.arrow.com/aropdfconversion/3cece72dd289ffbadc164fbcd05f638dd7240f7b/rc_datasheet_150330.pdf.pdf?authToken=eyJ0eXAiOiJKV1QiLCJhbGciOiJIUzI1NiJ9.eyJTZXNzaW9uSWQiOiJtY3ZlYXdxYmptZXdpdXdyeG1ha2FxdWciLCJEb3dubG9hZFR5cGUiOiJEYXRhc2hlZXRzIiwiaXNzIjoic2VsZiIsImF1ZCI6Imh0dHA6Ly9kYXRhc2hlZXRhdXRoLmFycm93LmNvbSIsImV4cCI6MTQ3Njg1OTQ5NiwibmJmIjoxNDc2ODU5Mzc2fQ.1rZWSrRNyHkP6J5YmszFzS2kzmlbN9BKNvWJ4ACiP-Q; Datasheet Version: 09/2015; Composition: ThickFilm; Package Description: 2-Pin Chip Resistor, Body 1.6 x 0.8 mm; Height: 0.022"(0.55mm); Family: ChipResistor-SurfaceMount; Temperature Coefficient: -; Size / Dimension: 0.063"Lx0.031"W(1.60mmx0.80mm); Part Number: RC1608J000CS
R75 = CMP-2000-03201-1: Manufacturer: Vishay Dale; Part Number: CRCW06032M70JNEA
R76 R77 R80 = CMP-1012-00793-1: 330K 0.1W 1% 0603 (1608 Metric)  SMD; Case-EIA: 0603; Case-Metric: 1608; Technology: SMT; Tolerance: 1 %
R78 R79 R81 R82 = CMP-2003-00545-1: Res Thick Film 1206 10k Ohms 5% 1/4W; Manufacturer: Panasonic; Alternative1: CR1206F-10KFI TT Welwyn; Alternative2: WR12X1002FGL Walsin Technologies; Alternative3: CR1206-FX-1002ELF Bourns; Part Number: ERJ-8GEYJ103V; Package / Case: 1206
R83 = CMP-2000-06934-1: Thick Film Resistor, 2.2 KOhm, 100 mW, 50 V, +/- 1%, -55 to 155 degC, 2-Pin SMD (0603), RoHS, Tape and Reel; Manufacturer: Yageo; Temperature Coefficient: 100PPM/C; Voltage: 50V; Alternative1: RC0603FR-102K2L Yageo; Alternative2: RMCF0603FT2K20 Stackpole Electronics; Alternative3: CRCW06032K20FKEA Vishay; Tolerance: 1%; Datasheet Version: Rev. 7, 05/2017; Case Code - mm: 1608; Series: RC; Mounting Technology: SurfaceMount; Package Description: 2-Pin Surface Mount Device, Body 1.6 x 0.8 mm; Package / Case: 0603; Package Reference: 0603; Product: ThickFilmResistorsGeneralPurpose; Manufacturer URL: http://www.yageo.com/; Termination Style: SMD/SMT; Operating Temperature Range: -55Cto+155C; Datasheet URL: http://www.yageo.com/documents/recent/PYu-RC_Group_51_RoHS_L_7.pdf; Packaging: Reel
U10 U12 = MAX4466EXK: Integrated Circuit; Manufacturer_Name: Maxim Integrated; Datasheet Link: https://datasheets.maximintegrated.com/en/ds/MAX4465-MAX4469.pdf; Height: 1.45mm; Manufacturer_Part_Number: MAX4466EXK; Arrow Part Number: MAX4466EXK
U11 = CMP-0003-00374-2: 12-Bit ADC with Integrated Multiplexer, PGA, Comparator, Oscillator, and Reference, -40 to 125 degC, 10-pin SOP (DGS10), Green (RoHS & no Sb/Br); Manufacturer: Texas Instruments; # Input Channels: 4; Digital Supply(Max)(V): 5.5; Resolution(Bits): 12; Digital Supply(Min)(V): 2; Architecture: Delta-Sigma; Sample Rate (max)(SPS): 3.3k; SubFamily: Precision ADC (<=10MSPS); INL(Max)(+/-LSB): 0.5; Interface: Serial I2C; ComponentLink1Description: Manufacturer URL; PartNumber: ADS1015IDGSR; PackageDescription: 10-Pin Plastic Small Outline, Body 3 x 3 mm, Pitch 0.5 mm; PackageVersion: 4073272/C, 02/2004; ComponentLink3URL: http://www.ti.com/lit/ml/mpds035b/mpds035b.pdf; Eco-Plan: Green (RoHS & no Sb/Br); ComponentLink2URL: http://www.ti.com/general/docs/lit/getliterature.tsp?genericPartNumber=ADS1015&fileType=pdf; Mounting Technology: Surface Mount; ComponentLink1URL: http://www.ti.com/; DatasheetVersion: SBAS473C; Analog Voltage AV/DD(Min)(V): 2; ComponentLink2Description: Datasheet; Code_JEDEC: MO-153; Analog Voltage AV/DD(Max)(V): 5.5; PackageReference: DGS10; ComponentLink3Description: Package Specification

## Sheet Accelerometer.SchDoc
size A3
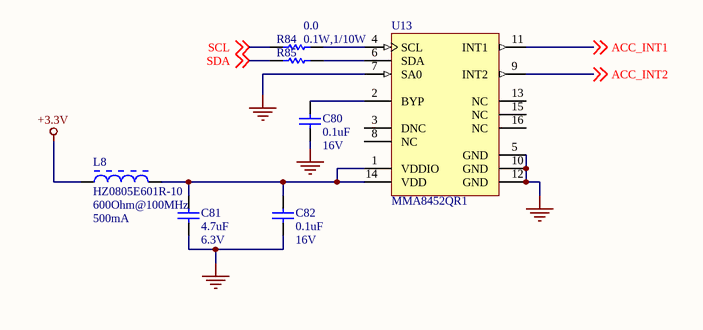
[diagram p9: Accelerometer.SchDoc]

### Parts
C80  value 0.1uF  Voltage: 16V  [CAPC1608X87X35ML15T15]  (hidden comment: C0603C104M4RACTU)
C81  value 4.7uF  Voltage: 6.3V  [CAPC2013X145X50NL20T25]  (hidden comment: C0805C475K9PACTU)
C82  value 0.1uF  Voltage: 16V  [CAPC1608X87X35ML15T15]  (hidden comment: C0603C104M4RACTU)
L8  HZ0805E601R-10  Impedance @ Frequency: 600Ohm@100MHz  Current Rating (Max): 500mA  [LIRD-LI0805H151R-10-2_V]
R84  value 0.0  Power: 0.1W,1/10W  [RESC1608X55X35LL10T10]  (hidden comment: RC1608J000CS)
R85  RC1608J000CS  [RESC1608X55X35LL10T10]  (value not drawn)
U13  MMA8452QR1  [FREE-QFN-16_V]

### Nets
+3.3V: L8.1
GND: C80.1 C81.1 C82.1 U13.5(GND) U13.7(SA0) U13.10(GND) U13.12(GND)
ACC_INT1: U13.11(INT1) ; off-sheet ACC_INT1  [project net IO_T11]
ACC_INT2: U13.9(INT2) ; off-sheet ACC_INT2  [project net IO_T10]
SCL: R84.1 ; off-sheet SCL
SDA: R85.1 ; off-sheet SDA
NetC80_2: C80.2 U13.2(BYP)
NetC81_2: C81.2 C82.2 L8.2 U13.1(VDDIO) U13.14(VDD)
NetR84_2: R84.2 U13.4(SCL)
NetR85_2: R85.2 U13.6(SDA)

Not connected (* = marked no-connect by the designer): U13 3(DNC) 8(NC) 13(NC) 15(NC) 16(NC)

### Notes on the sheet
- Title
- Size:
- Date:
- A3
- Number:
- Time:
- Revision:
- Sheet
- of
- File:

### Library data of the parts
C80 C82 = CMP-2006-03067-1: as C72 on sheet analog_front_end; Part Number: C0603C104M4RACTU; Package / Case: 0603
C81 = CMP-2007-01009-1: as C73 on sheet analog_front_end; Part Number: C0805C475K9PACTU; Package / Case: 0805
L8 = CMP-2000-05194-1: as L6 on sheet analog_front_end; Operating Temperature: -40degC~125degC; Datasheet URL: https://datasheet.ciiva.com/22622/1685710-22622833.pdf; Mounting Type: SurfaceMount; Package / Case: 0805(2012Metric); Package Description: 2-Pin Surface Mount Device, Body 2 x 1.25 mm; Package Reference: LI0805H15R-10-2; Size / Dimension: 0.079"Lx0.049"W(2.00mmx1.25mm); Height (Max): 0.043"(1.10mm); Part Number: HZ0805E601R-10
R84 = CMP-2000-06972-1: as R73 on sheet analog_front_end; Manufacturer URL: http://www.samsungsem.com/global/index.jsp; Features: MoistureResistant; Mounting Technology: SurfaceMount; Series: RC; Package / Case: 0603(1608Metric); Category: Resistors; Operating Temperature: -55°C~155°C; Datasheet URL: http://static6.arrow.com/aropdfconversion/3cece72dd289ffbadc164fbcd05f638dd7240f7b/rc_datasheet_150330.pdf.pdf?authToken=eyJ0eXAiOiJKV1QiLCJhbGciOiJIUzI1NiJ9.eyJTZXNzaW9uSWQiOiJtY3ZlYXdxYmptZXdpdXdyeG1ha2FxdWciLCJEb3dubG9hZFR5cGUiOiJEYXRhc2hlZXRzIiwiaXNzIjoic2VsZiIsImF1ZCI6Imh0dHA6Ly9kYXRhc2hlZXRhdXRoLmFycm93LmNvbSIsImV4cCI6MTQ3Njg1OTQ5NiwibmJmIjoxNDc2ODU5Mzc2fQ.1rZWSrRNyHkP6J5YmszFzS2kzmlbN9BKNvWJ4ACiP-Q; Datasheet Version: 09/2015; Composition: ThickFilm; Package Description: 2-Pin Chip Resistor, Body 1.6 x 0.8 mm; Height: 0.022"(0.55mm); Family: ChipResistor-SurfaceMount; Temperature Coefficient: -; Size / Dimension: 0.063"Lx0.031"W(1.60mmx0.80mm); Part Number: RC1608J000CS
R85 = CMP-2000-06972-1: as R74 on sheet analog_front_end; Manufacturer URL: http://www.samsungsem.com/global/index.jsp; Features: MoistureResistant; Mounting Technology: SurfaceMount; Series: RC; Package / Case: 0603(1608Metric); Category: Resistors; Operating Temperature: -55°C~155°C; Datasheet URL: http://static6.arrow.com/aropdfconversion/3cece72dd289ffbadc164fbcd05f638dd7240f7b/rc_datasheet_150330.pdf.pdf?authToken=eyJ0eXAiOiJKV1QiLCJhbGciOiJIUzI1NiJ9.eyJTZXNzaW9uSWQiOiJtY3ZlYXdxYmptZXdpdXdyeG1ha2FxdWciLCJEb3dubG9hZFR5cGUiOiJEYXRhc2hlZXRzIiwiaXNzIjoic2VsZiIsImF1ZCI6Imh0dHA6Ly9kYXRhc2hlZXRhdXRoLmFycm93LmNvbSIsImV4cCI6MTQ3Njg1OTQ5NiwibmJmIjoxNDc2ODU5Mzc2fQ.1rZWSrRNyHkP6J5YmszFzS2kzmlbN9BKNvWJ4ACiP-Q; Datasheet Version: 09/2015; Composition: ThickFilm; Package Description: 2-Pin Chip Resistor, Body 1.6 x 0.8 mm; Height: 0.022"(0.55mm); Family: ChipResistor-SurfaceMount; Temperature Coefficient: -; Size / Dimension: 0.063"Lx0.031"W(1.60mmx0.80mm); Part Number: RC1608J000CS
U13 = CMP-1750-00003-1: 3-Axis, 12-Bit / 8-Bit Digital Acceleromete, 1.95 to 3.6 V, -40 to 85 degC, 16-Pin QFN, RoHS, Tape and Reel; Elements: 1; Nominal Vgs: -3.5 V; Typical Rise Time: 8 ns; Nominal Dual Supply Voltage: -60 V; Rds On Max: 14 Ohm; Input Capacitance: 50 pF; Case\Package: TO-226-3; Max Power Dissipation: 625 mW; ComponentLink1URL: http://www.nxp.com/; ComponentLink2URL: http://cache.nxp.com/files/sensors/doc/data_sheet/MMA8452Q.pdf; ComponentLink2Description: Datasheet; Length: 4.77 mm; ComponentLink1Description: Manufacturer URL; Mount: Through Hole; REACH SVHC: No SVHC; Packaging: Bulk; PackageReference: QFN-16; Max Operating Temperature: 150 degC; Min Operating Temperature: -55 degC; Height: 4.01 mm; Pins: 3; Radiation Hardening: No; Weight: 0.016 oz; RoHSCompliant: true; Width: 2.41 mm; Package Quantity: 4000; PackageDescription: 16-Pin Quad Flat No-lead Package, Body 3 x 3 mm , Pitch 0.5 mm; DatasheetVersion: Rev. 10, 04/2016

## Nets that join several sheets
+3.3V: Bank1_I_O (8 pins), bluetooth (L2.1 L3.1 R43.1 R44.2), DC-DC-Converters (19 pins), usb2jtag (19 pins), analog_front_end (J6.1 L7.1 R75.2 R79.1), Accelerometer (L8.1)
+BATT: DC-DC-Converters (J2.1 J3.1 R25.1 U2.5), analog_front_end (J6.3)
GND: Bank0_I_O (9 pins), Bank1_I_O (6 pins), Bank2_I_O (6 pins), Bank3-4-5_I_O (9 pins), bluetooth (17 pins), DC-DC-Converters (26 pins), Power_Decap (34 pins), usb2jtag (30 pins), analog_front_end (17 pins), Accelerometer (7 pins)
VCC_CORE: DC-DC-Converters (R29.2 R30.2 TP30.1), Power_Decap (18 pins)
VCCIO0: Bank0_I_O (13 pins), DC-DC-Converters (R26.2 R31.2 TP31.1), usb2jtag (J5.1 R65.2 R66.2 R67.2)
VCCIO1: Bank1_I_O (10 pins), DC-DC-Converters (R27.2 R32.2 TP32.1)
VCCIO2: Bank2_I_O (11 pins), DC-DC-Converters (R28.2 R33.2 TP33.1)
VCCIO3: Bank3-4-5_I_O (C20.1 C21.1 C22.1 U1.M4), DC-DC-Converters (R35.2 R38.2 TP34.1)
VCCIO4: Bank3-4-5_I_O (5 pins), DC-DC-Converters (R36.2 R39.2 TP35.1)
VCCIO5: Bank3-4-5_I_O (C23.1 C24.1 C25.1 U1.E4), DC-DC-Converters (R37.2 R40.2 TP36.1)
12MHZ: Bank0_I_O (U1.C8), usb2jtag (R64.1)
BM71_MODE: Bank2_I_O (TP23.1 U1.T13), bluetooth (R46.1 U6.16)
COMP_IN1: Bank2_I_O (U1.T2), bluetooth (R42.1), analog_front_end (5 pins)
COMP_IN2: Bank2_I_O (U1.R3), analog_front_end (C79.1 R83.2 TP52.1 U10.3)
CTSn: Bank0_I_O (U1.B11), usb2jtag (R57.2)
D_N: DC-DC-Converters (J4.2), usb2jtag (U9.7)
D_P: DC-DC-Converters (J4.3), usb2jtag (U9.8)
DCDn: Bank0_I_O (U1.B13), usb2jtag (R54.2)
DSRn: Bank0_I_O (U1.A12), usb2jtag (R55.2)
DTRn: Bank0_I_O (U1.D11), usb2jtag (R56.2)
ESP32_UART_RX: Bank2_I_O (TP25.1 U1.T15), bluetooth (U5.24 U6.7)
ESP32_UART_TX: Bank2_I_O (TP26.1 U1.R14), bluetooth (U5.23 U6.8)
FTDI_SCL: Bank2_I_O (R22.2 TP29.1), usb2jtag (R61.2)
FTDI_SDA: Bank2_I_O (R21.2 TP28.1), usb2jtag (R62.2 R63.2)
IO_R13: Bank2_I_O (TP17.1 U1.R13), analog_front_end (Q5.1 R82.1)
IO_T5: Bank2_I_O (TP14.1 U1.T5), analog_front_end (U10.4)
IO_T7: Bank2_I_O (TP21.1 U1.T7), analog_front_end (TP45.1 U11.2)
IO_T9: Bank2_I_O (TP9.1 U1.T9), analog_front_end (R83.1 TP53.1)
IO_T10: Bank2_I_O (TP12.1 U1.T10), Accelerometer (U13.9)
IO_T11: Bank2_I_O (TP16.1 U1.T11), Accelerometer (U13.11)
IO_T14: Bank2_I_O (TP18.1 U1.T14), bluetooth (Q1.1 Q3.1 R41.1 R45.1)
LBO: Bank2_I_O (TP11.1 U1.T3), DC-DC-Converters (R23.2 U2.4)
MCLK: Bank2_I_O (J1.6 R17.1), bluetooth (U5.28)
RI: Bank0_I_O (U1.A14), usb2jtag (R53.2)
RS232_Rx_TTL: Bank0_I_O (U1.A11), usb2jtag (R60.2)
RS232_Tx_TTL: Bank0_I_O (U1.C11), usb2jtag (R59.2)
RTSn: Bank0_I_O (U1.F10), usb2jtag (R58.2)
SCL: Bank0_I_O (R4.2), Bank2_I_O (J1.2), analog_front_end (R73.2 TP43.1), Accelerometer (R84.1)
SCL_1: Bank0_I_O (R3.1 U1.A9), Bank2_I_O (R22.1)
SDA: Bank0_I_O (R6.2), Bank2_I_O (J1.1), analog_front_end (R74.2 TP44.1), Accelerometer (R85.1)
SDA_1: Bank0_I_O (R5.1 U1.C9), Bank2_I_O (R21.1)
SISPI: Bank2_I_O (J1.5 R20.2), bluetooth (U5.27)
SPISO: Bank2_I_O (J1.4 R18.1), bluetooth (U5.21)
TCK: Bank0_I_O (U1.A7), usb2jtag (J5.8 R68.1 R69.1)
TDI: Bank0_I_O (U1.A6), usb2jtag (J5.3 R66.1 R70.1)
TDO: Bank0_I_O (U1.C6), usb2jtag (J5.2 R67.1 R71.1)
TMS: Bank0_I_O (U1.B8), usb2jtag (J5.6 R65.1 R72.1)
USB_I2C_EN: Bank2_I_O (TP27.1), usb2jtag (U9.26)

## Assembly variants
Assembly: not fitted J1 R7 R8 R9 R10 R11 R12 R13 R14 R15 R16 R17 R29 R30 R31 R32 R33 R34 R35 R36 R38 R39 R40 R41 R42 R43 U2